# EAGLE design xth-sense-wireless (EAGLE 6.4)
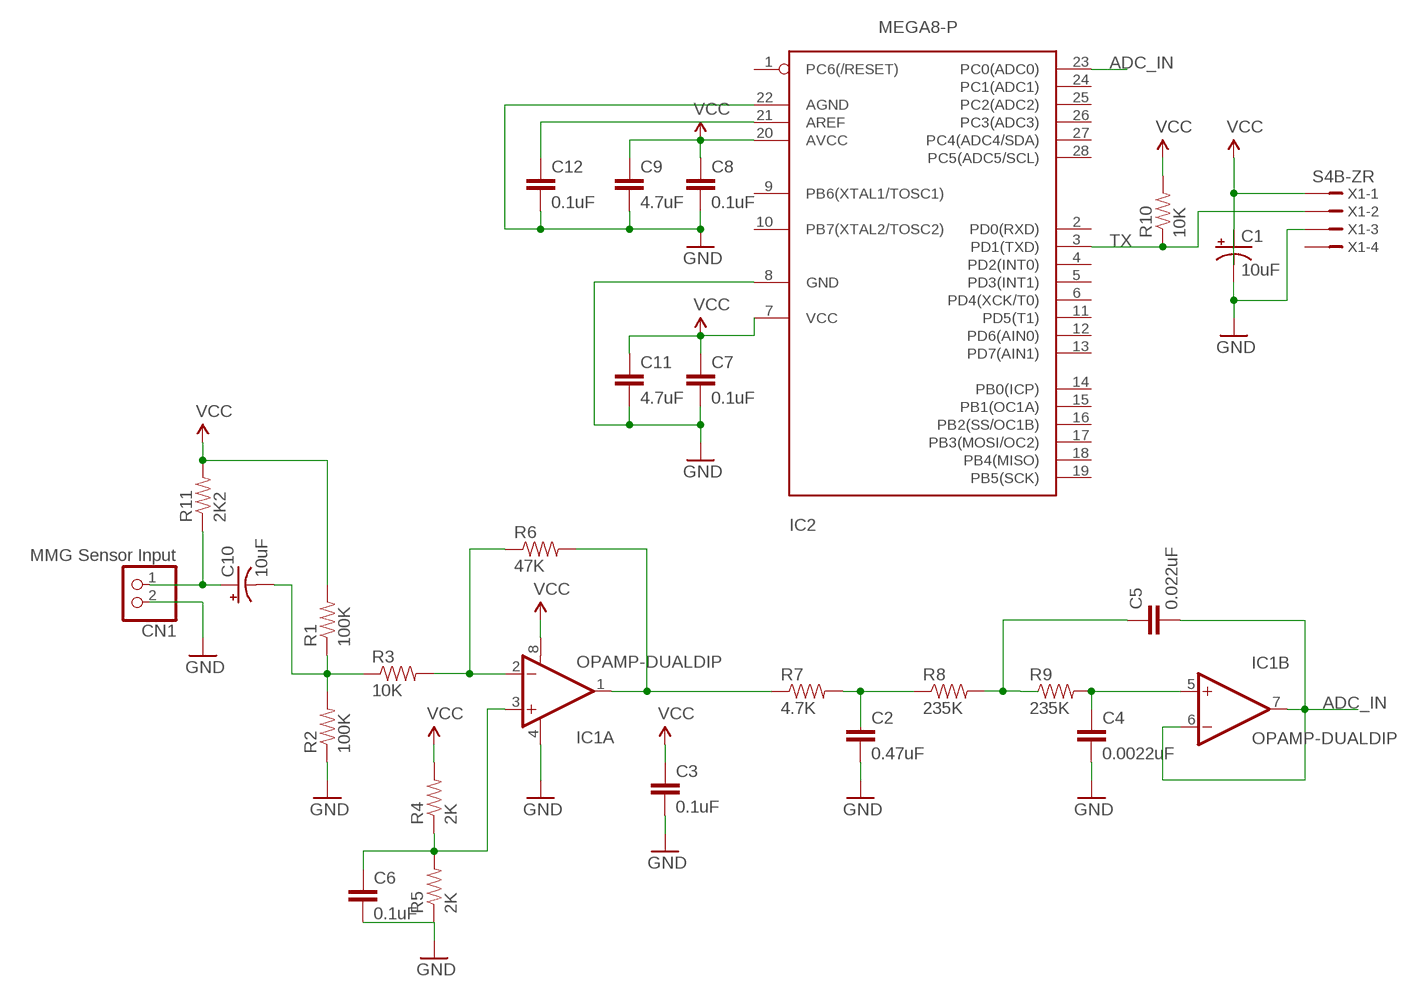
[diagram p0: schematic, sheet 1]

## Parts
C1  10uF  CAP_POLPTH2  [CPOL-RADIAL-10UF-25V]
C2  0.47uF  CAPPTH  [CAP-PTH-SMALL]
C3  0.1uF  CAPPTH  [CAP-PTH-SMALL]
C4  0.0022uF  CAPPTH  [CAP-PTH-SMALL]
C5  0.022uF  CAPPTH  [CAP-PTH-SMALL]
C6  0.1uF  CAPPTH  [CAP-PTH-SMALL]
C7  0.1uF  CAPPTH  [CAP-PTH-SMALL]
C8  0.1uF  CAPPTH  [CAP-PTH-SMALL]
C9  4.7uF  CAPPTH  [CAP-PTH-SMALL]
C10  10uF  CAP_POLPTH2  [CPOL-RADIAL-10UF-25V]
C11  4.7uF  CAPPTH  [CAP-PTH-SMALL]
C12  0.1uF  CAPPTH  [CAP-PTH-SMALL]
CN1  MMG Sensor Input  JST_2PIN-THM-RA  [JST-PH-2-THM-RA]
IC1  OPAMP-DUALDIP  [DIP08]
IC2  MEGA8-P  [DIL28-3]
R1  100K  RESISTORPTH1  [AXIAL-0.3]
R2  100K  RESISTORPTH1  [AXIAL-0.3]
R3  10K  RESISTORPTH1  [AXIAL-0.3]
R4  2K  RESISTORPTH1  [AXIAL-0.3]
R5  2K  RESISTORPTH1  [AXIAL-0.3]
R6  47K  RESISTORPTH1  [AXIAL-0.3]
R7  4.7K  RESISTORPTH1  [AXIAL-0.3]
R8  235K  RESISTORPTH1  [AXIAL-0.3]
R9  235K  RESISTORPTH1  [AXIAL-0.3]
R10  10K  RESISTORPTH1  [AXIAL-0.3]
R11  2K2  RESISTORPTH1  [AXIAL-0.3]
X1  S4B-ZR  [S4B-ZR]

## Nets
ADC_IN: C5.2 IC1.6(B:-IN) IC1.7(B:OUT) IC2.23(PC0(ADC0))
GND: C1.2(-) C2.2 C3.2 C4.2 C6.2 C7.2 C8.2 C9.2 C11.2 C12.2 CN1.2 IC1.4(A:V-) IC2.8(GND) IC2.22(AGND) R2.P$1 R5.P$1 X1.3
N$1: C10.2(-) R1.P$1 R2.P$2 R3.P$1
N$3: IC1.1(A:OUT) R6.P$2 R7.P$1
N$4: IC1.2(A:-IN) R3.P$2 R6.P$1
N$5: C2.1 R7.P$2 R8.P$1
N$6: C10.1(+) CN1.1 R11.P$1
N$7: C4.1 IC1.5(B:+IN) R9.P$2
N$8: C5.1 R8.P$2 R9.P$1
N$9: C12.1 IC2.21(AREF)
TX: IC2.3(PD1(TXD)) R10.P$1 X1.2
VCC: C1.1(+) C3.1 C7.1 C8.1 C9.1 C11.1 IC1.8(A:V+) IC2.7(VCC) IC2.20(AVCC) R1.P$2 R4.P$2 R10.P$2 R11.P$2 X1.1
VIRT_GND: C6.1 IC1.3(A:+IN) R4.P$1 R5.P$2
Unconnected: IC2.1(PC6(/RESET)) IC2.2(PD0(RXD)) IC2.4(PD2(INT0)) IC2.5(PD3(INT1)) IC2.6(PD4(XCK/T0)) IC2.9(PB6(XTAL1/TOSC1)) IC2.10(PB7(XTAL2/TOSC2)) IC2.11(PD5(T1)) IC2.12(PD6(AIN0)) IC2.13(PD7(AIN1)) IC2.14(PB0(ICP)) IC2.15(PB1(OC1A)) IC2.16(PB2(SS/OC1B)) IC2.17(PB3(MOSI/OC2)) IC2.18(PB4(MISO)) IC2.19(PB5(SCK)) IC2.24(PC1(ADC1)) IC2.25(PC2(ADC2)) IC2.26(PC3(ADC3)) IC2.27(PC4(ADC4/SDA)) IC2.28(PC5(ADC5/SCL)) X1.4

## Library data of the parts
C1 C10 = SparkFun:CAP_POL: Capacitor Polarized These are standard SMD and PTH capacitors. Normally 10uF, 47uF, and 100uF in electrolytic and tantalum varieties. Always verify the external diameter of the through hole cap, it varies with capacity, voltage, and manufacturer. The EIA devices should be standard.
C2-C9 C11 C12 = SparkFun:CAP: Capacitor Standard 0603 ceramic capacitor, and 0.1" leaded capacitor.
CN1 = adafruit:JST_2PIN: JST 2-Pin Connectors of various flavors SMT-RA (S2B-PH-SM4) 4UConnector #17311 SMT (B2B-PH-SM4) THM-RA (S2B-PH) THM (B2B-PH)
IC1 = SparkFun:OPAMP-DUAL: Operational Amplifier
IC2 = avr-7:MEGA8-P: MICROCONTROLLER 8 Kbytes FLASH 1 kbytes SRAM 512 bytes EEPROM USART 4-channel 10 bit ADC 2-channel 8 bit ADC
R1-R11 = SparkFun:RESISTOR: Resistor Basic schematic elements and footprints for 0603, 1206, and PTH 1/10th watt (small) resistors.
X1 = con-jst:?4B-ZR: ZH CONNECTOR 1.5 mm, 4 pin 1 row Source: http://www.jst.com .. eZH.pdf; MF: FARNELL; MPN: S4B-ZR(LF)(SN); OC_FARNELL: 9491830; OC_NEWARK: 38K8076

## Board
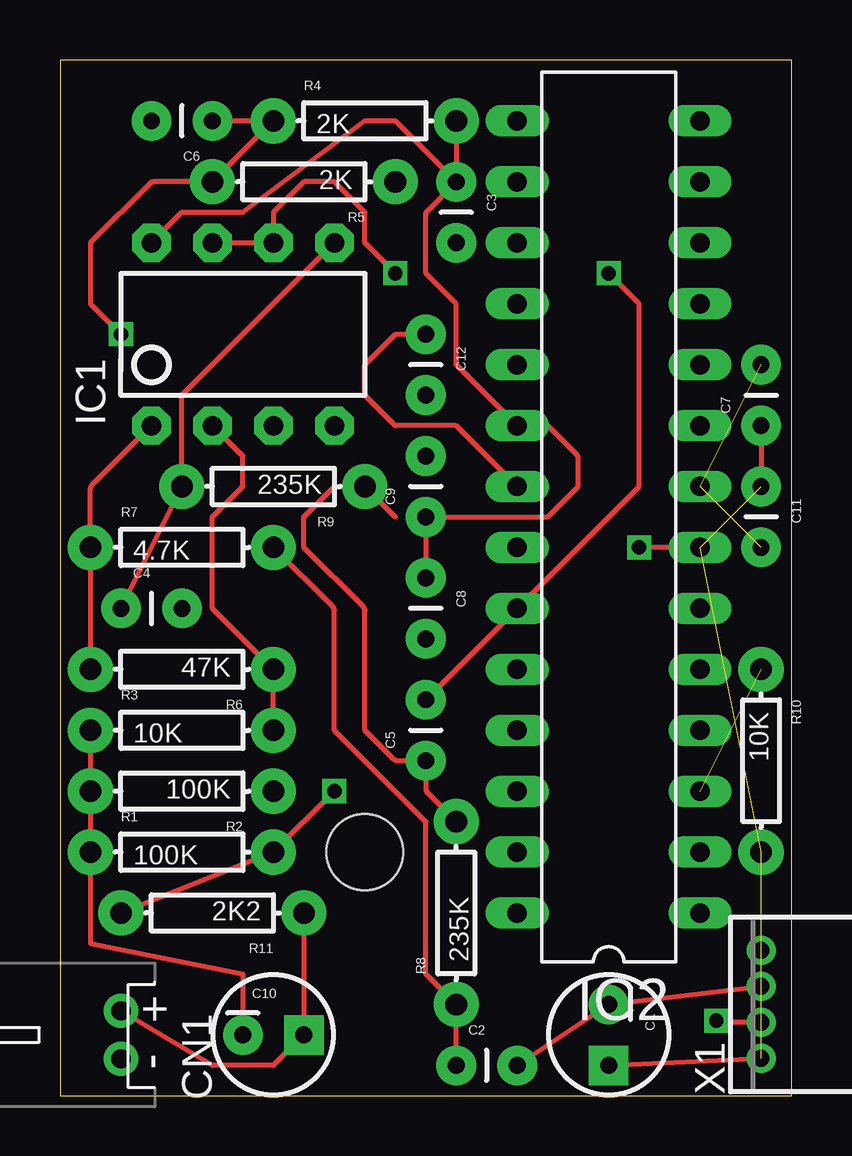
[diagram p1: board, top side]
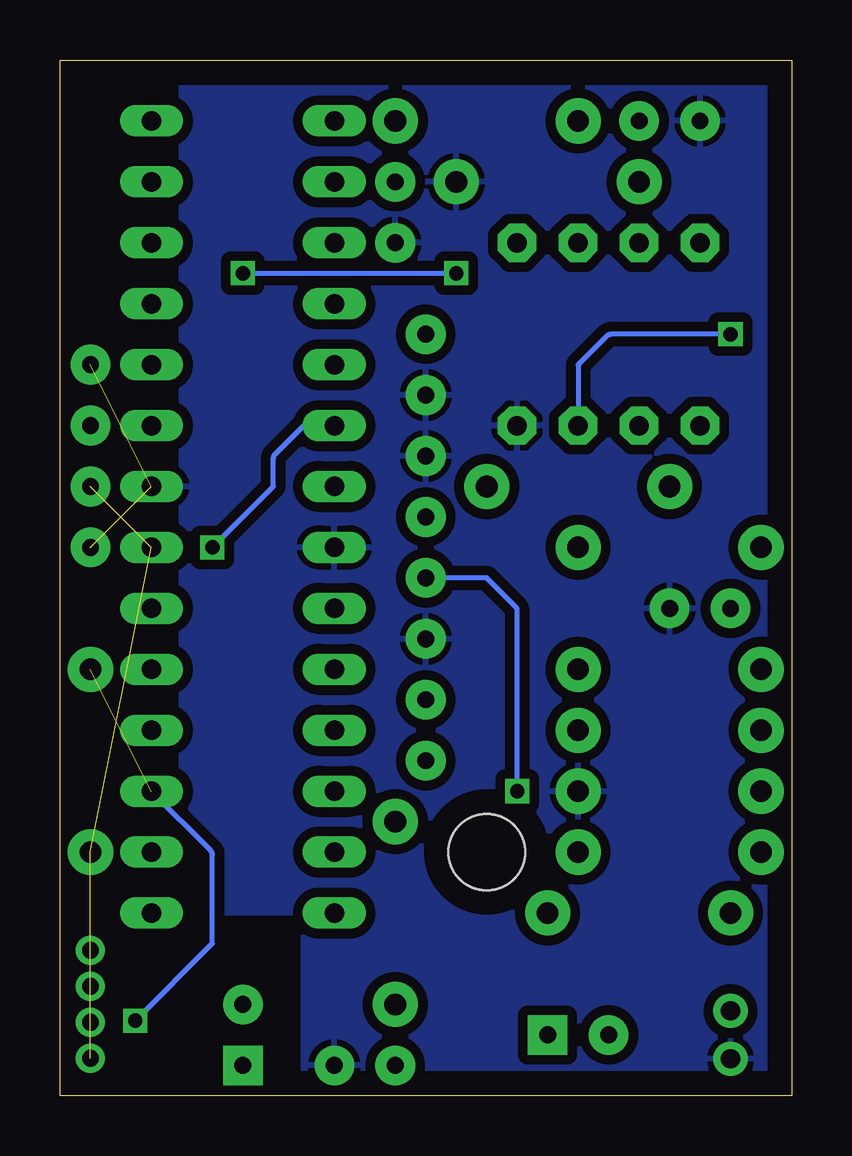
[diagram p2: board, bottom side, seen from below]

Size 30.48 x 43.18 mm. Coordinates in mm from the lower left corner, seen from the top.
Outline: 0,0 30.48,0 30.48,43.18 0,43.17 0,0
Copper layers (1*16): Top 0.035mm / dielectric 1.5mm / Bottom 0.035mm
Design rules "default": minimum track width 10mil, minimum drill 24mil, track to track 8mil, track to pad 8mil, pad to pad 8mil, via to via 8mil, smd to smd 8mil, copper to edge 40mil, drill to drill 8mil, minimum pad ring 10mil, minimum via ring 8mil, stop-mask expansion 4mil, vias tented up to drill 0mil, thermal gap 10mil
Holes 3.17 mm at 12.7,10.16

### Footprints (pad centres in the part's own frame; a part is rotated, then mirrored left to right if it is on the bottom)
CPOL-RADIAL-10UF-25V = drill 0.7 pad 1.651 square: 1 1.27,0 | drill 0.7 pad 1.651: 2 -1.27,0
CAP-PTH-SMALL = drill 0.7 pad 1.651: 1 0,0; 2 2.54,0
JST-PH-2-THM-RA = drill 0.8 pad 1.422: 1 1,0; 2 -1,0
DIP08 = drill 0.813 pad 1.6 octagon: 1 -3.81,-3.81; 2 -1.27,-3.81; 3 1.27,-3.81; 4 3.81,-3.81; 5 3.81,3.81; 6 1.27,3.81; 7 -1.27,3.81; 8 -3.81,3.81
DIL28-3 = drill 0.813 long: 1 -16.51,-3.81; 2 -13.97,-3.81; 3 -11.43,-3.81; 4 -8.89,-3.81; 5 -6.35,-3.81; 6 -3.81,-3.81; 7 -1.27,-3.81; 8 1.27,-3.81; 9 3.81,-3.81; 10 6.35,-3.81; 11 8.89,-3.81; 12 11.43,-3.81; 13 13.97,-3.81; 14 16.51,-3.81; 15 16.51,3.81; 16 13.97,3.81; 17 11.43,3.81; 18 8.89,3.81; 19 6.35,3.81; 20 3.81,3.81; 21 1.27,3.81; 22 -1.27,3.81; 23 -3.81,3.81; 24 -6.35,3.81; 25 -8.89,3.81; 26 -11.43,3.81; 27 -13.97,3.81; 28 -16.51,3.81
AXIAL-0.3 = drill 0.9 pad 1.88: P$1 -3.81,0; P$2 3.81,0
S4B-ZR = drill 0.7 pad 1.1: 1 -2.25,0; 2 -0.75,0; 3 0.75,0; 4 2.25,0

### Placement (x,y rotation side)
C1  22.86,2.54 270 top
C2  16.51,1.27 0 top
C3  16.51,38.1 270 top
C4  2.54,20.32 0 top
C5  15.24,13.97 90 top
C6  6.35,40.64 180 top
C7  29.21,27.94 90 top
C8  15.24,21.59 270 top
C9  15.24,24.13 90 top
C10  8.89,2.54 0 top
C11  29.21,25.4 270 top
C12  15.24,31.75 270 top
CN1  2.54,2.54 90 top
IC1  7.62,31.75 0 top
IC2  22.86,24.13 90 top
R1  5.08,10.16 0 top
R2  5.08,12.7 180 top
R3  5.08,15.24 0 top
R4  12.7,40.64 0 top
R5  10.16,38.1 180 top
R6  5.08,17.78 180 top
R7  5.08,22.86 0 top
R8  16.51,7.62 90 top
R9  8.89,25.4 180 top
R10  29.21,13.97 270 top
R11  6.35,7.62 180 top
X1  29.21,3.81 90 top

### Tracks (layer width: path | path; a pad name or v marks a point on that pad's centre or on a via)
ADC_IN  (via drill 0.6)
  Top 0.203: IC1.7 IC1.6 8.89,36.83 10.16,38.1 11.43,38.1 12.7,36.83 12.7,35.56 v13.97,34.29 | C5.2 IC2.23 24.13,25.4 24.13,33.02 v22.86,34.29
  Bottom 0.203: v22.86,34.29 v13.97,34.29
GND  (2 unrouted)
  Top 0.203: C2.2 C1.2 X1.3
  pour Bottom (isolate 0.406): 0,43.18 0,0 20.32,0 20.32,7.62 25.4,7.62 25.4,43.18
N$1
  Top 0.203: R3.P$1 R2.P$2 R1.P$1 1.27,6.35 7.62,5.08 C10.2
N$3
  Top 0.203: R6.P$2 R7.P$1 1.27,25.3 arc-45 1.34,25.47 IC1.1
N$4
  Top 0.203: R3.P$2 R6.P$1 6.35,20.32 6.35,24.13 7.62,25.4 7.62,26.67 IC1.2
N$5
  Top 0.203: C2.1 R8.P$1 15.24,5.08 15.24,11.43 11.43,15.24 11.43,20.21 arc45 11.36,20.39 R7.P$2
N$6
  Top 0.203: R11.P$1 C10.1 8.89,1.27 6.35,1.27 CN1.1
N$7
  Top 0.203: C4.1 R9.P$2 5.08,29.21 IC1.5
N$8
  Top 0.203: R8.P$2 15.31,12.63 arc-45 15.24,12.8 C5.1 14.07,13.97 arc-45 13.9,14.04 12.7,15.24 12.7,20.21 arc45 12.63,20.39 10.16,22.86 10.16,24.13 11.43,25.4 R9.P$1 13.97,24.13
N$9
  Top 0.203: IC2.21 16.51,27.94 13.97,27.94 12.7,29.21 12.7,30.48 13.97,31.75 C12.1
TX  (via drill 0.6)  (1 unrouted)
  Top 0.203: X1.2 27.52,3.06 arc-45 v27.35,3.13
  Bottom 0.203: v27.35,3.13 24.13,6.35 24.13,10.05 arc-45 24.2,10.23 IC2.3
VCC  (via drill 0.6)  (3 unrouted)
  Top 0.203: R11.P$2 R1.P$2 v11.43,12.7 | C1.1 X1.1 | R4.P$2 C3.1 | C8.1 C9.1 20.32,24.13 21.59,25.4 21.59,26.57 arc45 21.52,26.74 20.32,27.94 IC2.20 16.51,30.48 16.51,33.02 15.24,34.29 15.24,36.73 arc-45 15.31,36.9 C3.1 | C7.1 C11.1 | IC2.7 v24.13,22.86 | IC1.8 5.08,36.83 7.62,36.83 12.7,40.64 13.97,40.64 C3.1
  Bottom 0.203: v24.13,22.86 21.59,25.4 21.59,26.57 arc45 21.52,26.74 20.32,27.94 IC2.20 | v11.43,12.7 11.43,20.21 arc-45 11.5,20.39 12.7,21.59 C8.1
VIRT_GND  (via drill 0.6)
  Top 0.203: C6.1 R4.P$1 R5.P$2 3.92,38.1 arc45 3.74,38.03 1.27,35.56 1.27,33.02 v2.54,31.75
  Bottom 0.203: v2.54,31.75 7.51,31.75 arc-45 7.69,31.68 8.89,30.48 IC1.3